# Altium project Hub.PrjPCB
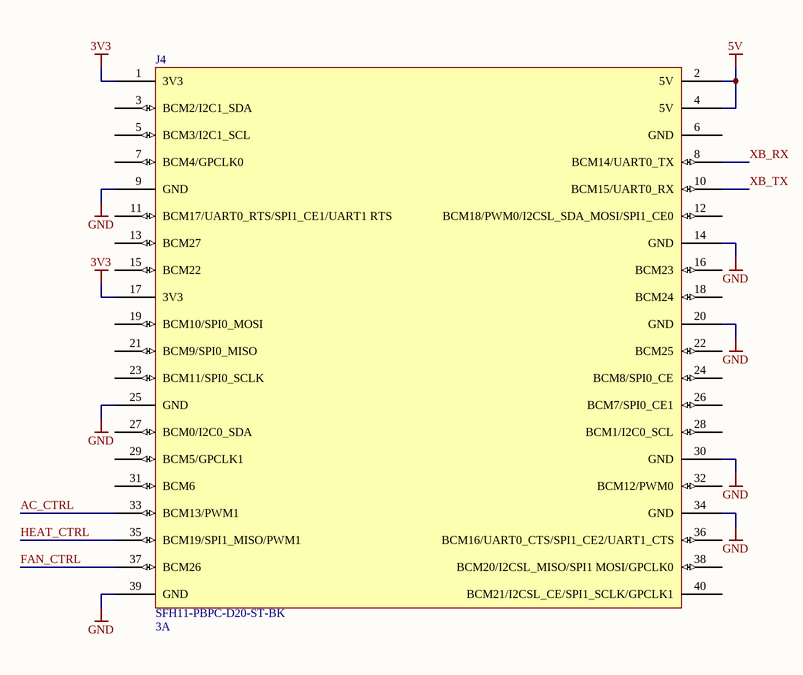
[diagram p0: Rpi.SchDoc]
4 sheets, 66 parts. Net scope: global (net labels, ports and power ports of the same name join across sheets).
Board file: Hub.PcbDoc
Sheets:
  Rpi.SchDoc
  Power.SchDoc
  Control.SchDoc
  Xbee.SchDoc

## Sheet Rpi.SchDoc
size A

### Parts
(Parts that share a designator on the sheet are numbered #1, #2 ... from top to bottom, then left to right.)
J4#1  Rating: 3A  [SFH11-PBPC-D20-ST-BK]  (hidden comment: J_RPI2B_ SFH11-PBPC-D20-ST-BK)

### Nets
3V3: J4#1.1(3V3) J4#1.17(3V3)
5V: J4#1.2(5V) J4#1.4(5V)
GND: J4#1.9(GND) J4#1.14(GND) J4#1.20(GND) J4#1.25(GND) J4#1.30(GND) J4#1.34(GND) J4#1.39(GND)
AC_CTRL: J4#1.33(BCM13/PWM1)
FAN_CTRL: J4#1.37(BCM26)
HEAT_CTRL: J4#1.35(BCM19/SPI1_MISO/PWM1)
XB_RX: J4#1.8(BCM14/UART0_TX)
XB_TX: J4#1.10(BCM15/UART0_RX)

Not connected (* = marked no-connect by the designer): J4#1 3(BCM2/I2C1_SDA) 5(BCM3/I2C1_SCL) 6(GND) 7(BCM4/GPCLK0) 11(BCM17/UART0_RTS/SPI1_CE1/UART1_RTS) 12(BCM18/PWM0/I2CSL_SDA_MOSI/SPI1_CE0) 13(BCM27) 15(BCM22) 16(BCM23) 18(BCM24) 19(BCM10/SPI0_MOSI) 21(BCM9/SPI0_MISO) 22(BCM25) 23(BCM11/SPI0_SCLK) 24(BCM8/SPI0_CE) 26(BCM7/SPI0_CE1) 27(BCM0/I2C0_SDA) 28(BCM1/I2C0_SCL) 29(BCM5/GPCLK1) 31(BCM6) 32(BCM12/PWM0) 36(BCM16/UART0_CTS/SPI1_CE2/UART1_CTS) 38(BCM20/I2CSL_MISO/SPI1_MOSI/GPCLK0) 40(BCM21/I2CSL_CE/SPI1_SCLK/GPCLK1)

### Library data of the parts
J4#1 = J_RPI2B_ SFH11-PBPC-D20-ST-BK: Manufacturer: Sullins Connector Solutions; PartNumber: SFH11-PBPC-D20-ST-BK

## Sheet Power.SchDoc
size A
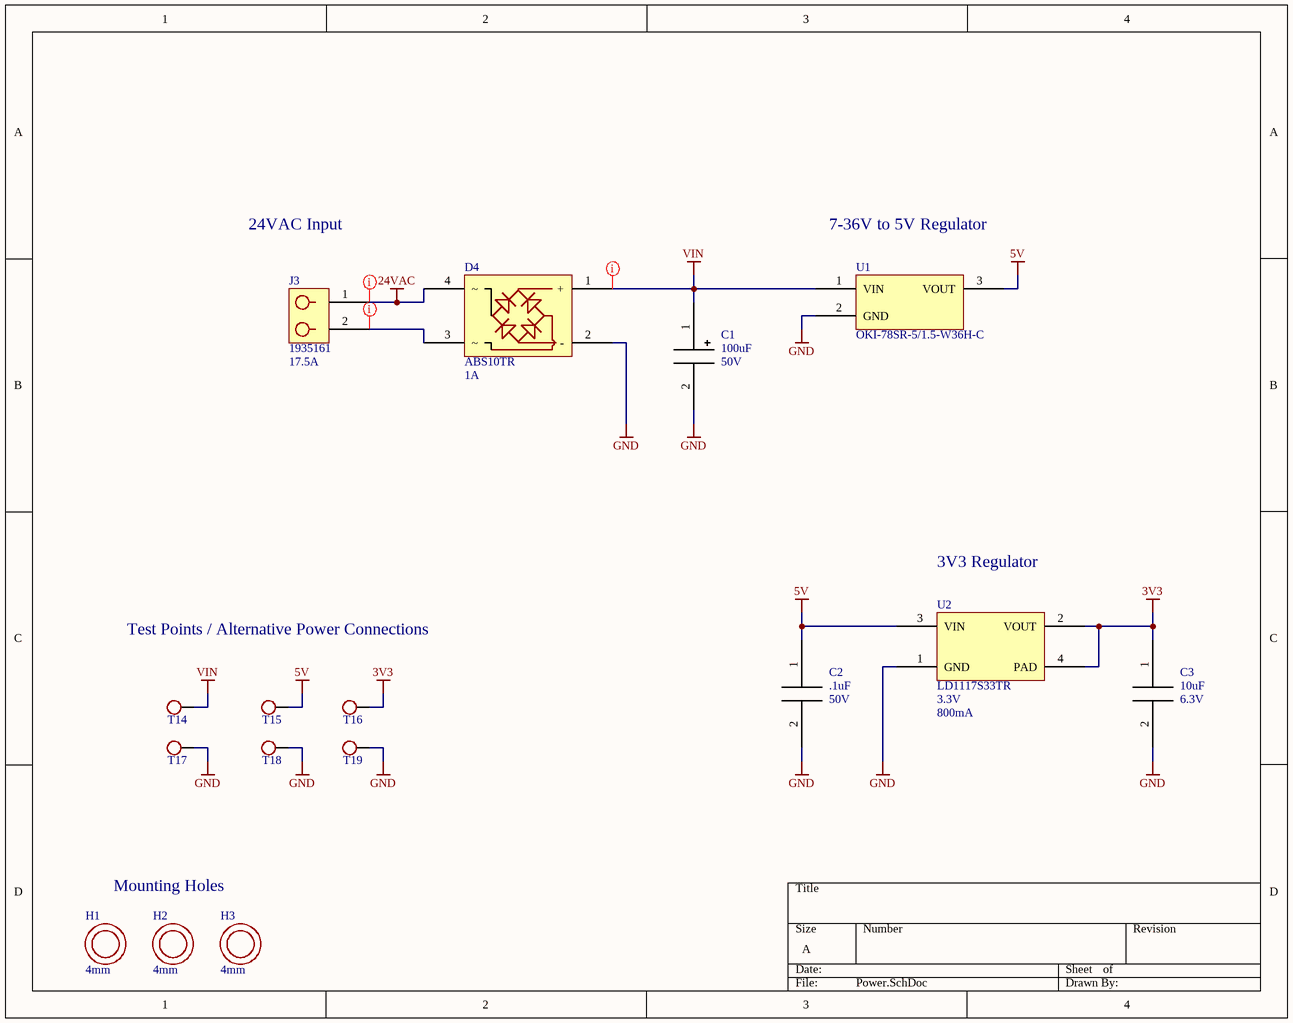
[diagram p1: Power.SchDoc]

### Parts
(Parts that share a designator on the sheet are numbered #1, #2 ... from top to bottom, then left to right.)
C1  value 100uF  Rating: 50V  [EEE-1HA101UP]  (hidden comment: CAP)
C2  value .1uF  Rating: 50V  [0603]  (hidden comment: *)
C3  value 10uF  Rating: 6.3V  [0603]  (hidden comment: *)
D4#1  Rating: 1A  PartNumber: ABS10TR  [ABS]  (hidden comment: D_RECTBRIDGE_ABS)
H1  value 4mm  [MOUNTHOLE4MM]  (hidden comment: H_MOUNTHOLE_MOUNTHOLE4MM)
H2  value 4mm  [MOUNTHOLE4MM]  (hidden comment: H_MOUNTHOLE_MOUNTHOLE4MM)
H3  value 4mm  [MOUNTHOLE4MM]  (hidden comment: H_MOUNTHOLE_MOUNTHOLE4MM)
J3#1  Rating: 17.5A  [1935161]  (hidden comment: J_2POSTERM_1935161)
T14#1  TESTPOINT  [TESTPOINT1MM]  (value not drawn)
T15#1  TESTPOINT  [TESTPOINT1MM]  (value not drawn)
T16#1  TESTPOINT  [TESTPOINT1MM]  (value not drawn)
T17#1  TESTPOINT  [TESTPOINT1MM]  (value not drawn)
T18#1  TESTPOINT  [TESTPOINT1MM]  (value not drawn)
T19#1  TESTPOINT  [TESTPOINT1MM]  (value not drawn)
U1  U_OKI-78SR-5/1.5-W36H-C_OKI-78SR-5/1.5-W36H-C  [OKI-78SR-5/1.5-W36H-C]  (value not drawn)
U2  value 3.3V  Rating: 800mA  PartNumber: LD1117S33TR  [SOT223]  (hidden comment: U_LD1117S33TR_SOT223)

### Nets
3V3: C3.1 T16#1.1 U2.2(VOUT) U2.4(PAD)
5V: C2.1 T15#1.1 U1.3(VOUT) U2.3(VIN)
24VAC: D4#1.4 J3#1.1
GND: C1.2 C2.2 C3.2 D4#1.2(-) T17#1.1 T18#1.1 T19#1.1 U1.2(GND) U2.1(GND)
VIN: C1.1 D4#1.1(+) T14#1.1 U1.1(VIN)
NetD4#1_3: D4#1.3 J3#1.2

### Layout directives
rule Clearance Constraint [Generic clearance = 25mil, and 9 value(s) for objects]; rule Width Constraint [Pref Width = 25mil    Min Width = 15mil    Max Width = 25mil]: 24VAC, NetD4#1_3, VIN

### Notes on the sheet
- 24VAC Input
- 7-36V to 5V Regulator
- 3V3 Regulator
- Test Points / Alternative Power Connections
- Mounting Holes

### Library data of the parts
C1 = C_CAP-P_EEE-1HA101UP: Manufacturer: Panasonic Electronic Components; PartNumber: EEE-1HA101UP
C2 = C_CAP_0603: PartNumber: C0603C104K5RACAUTO; Manufacturer: KEMET
C3 = C_CAP_0603: PartNumber: JMK107ABJ106MA-T; Manufacturer: Taiyo Yuden
D4#1 = D_RECTBRIDGE_ABS: Manufacturer: SMC Diode Solutions
J3#1 = J_2POSTERM_1935161: Manufacturer: Phoenix Contact; PartNumber: 1935161
T14#1 T15#1 T16#1 T17#1 T18#1 T19#1 = T_TESTPOINT_TESTPOINT1MM: Value: 1mm
U1 = U_OKI-78SR-5/1.5-W36H-C_OKI-78SR-5/1.5-W36H-C: Manufacturer: Murata Power Solutions Inc.; Rating: 1.5A; PartNumber: OKI-78SR-5/1.5-W36H-C

## Sheet Control.SchDoc
size A
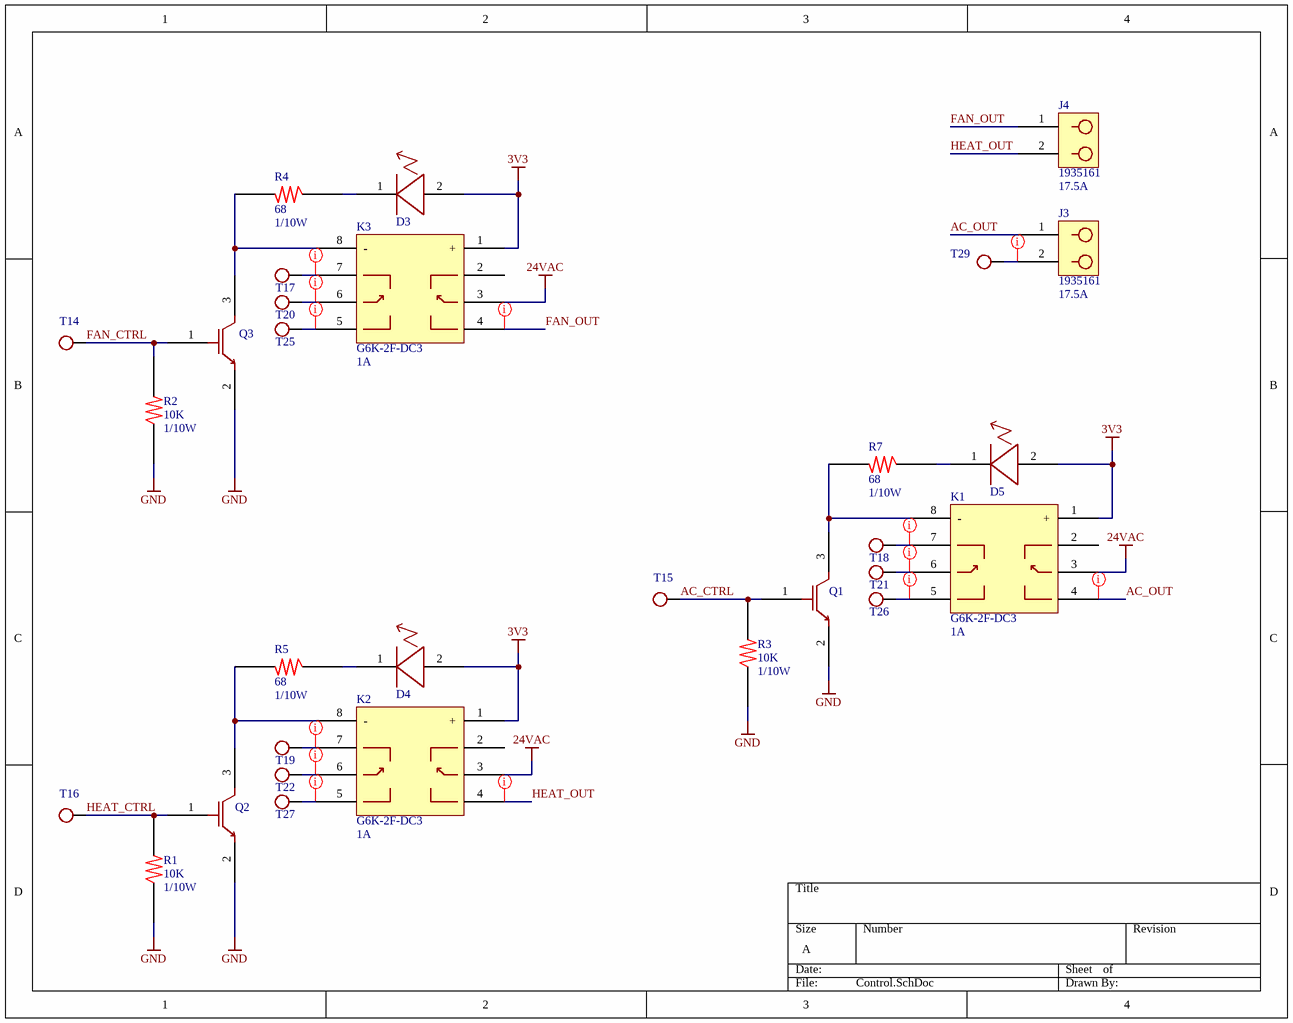
[diagram p2: Control.SchDoc]

### Parts
(Parts that share a designator on the sheet are numbered #1, #2 ... from top to bottom, then left to right.)
D3  D_LED_LED5MM  [LED5MM]  (value not drawn)
D4#2  D_LED_LED5MM  [LED5MM]  (value not drawn)
D5  D_LED_LED5MM  [LED5MM]  (value not drawn)
J3#2  Rating: 17.5A  [1935161]  (hidden comment: J_2POSTERM_1935161)
J4#2  Rating: 17.5A  [1935161]  (hidden comment: J_2POSTERM_1935161)
K1  Rating: 1A  PartNumber: G6K-2F-DC3  [G6K-2F]  (hidden comment: K_G6K-2F_G6K-2F)
K2  Rating: 1A  PartNumber: G6K-2F-DC3  [G6K-2F]  (hidden comment: K_G6K-2F_G6K-2F)
K3  Rating: 1A  PartNumber: G6K-2F-DC3  [G6K-2F]  (hidden comment: K_G6K-2F_G6K-2F)
Q1  Q_NFET_SOT23  [SOT23]  (value not drawn)
Q2  Q_NFET_SOT23  [SOT23]  (value not drawn)
Q3  Q_NFET_SOT23  [SOT23]  (value not drawn)
R1  value 10K  Rating: 1/10W  [0603]  (hidden comment: R_RES_0603)
R2  value 10K  Rating: 1/10W  [0603]  (hidden comment: R_RES_0603)
R3  value 10K  Rating: 1/10W  [0603]  (hidden comment: R_RES_0603)
R4  value 68  Rating: 1/10W  [0603]  (hidden comment: R_RES_0603)
R5  value 68  Rating: 1/10W  [0603]  (hidden comment: R_RES_0603)
R7  value 68  Rating: 1/10W  [0603]  (hidden comment: R_RES_0603)
T14#2  TESTPOINT  [TESTPOINT1MM]  (value not drawn)
T15#2  TESTPOINT  [TESTPOINT1MM]  (value not drawn)
T16#2  TESTPOINT  [TESTPOINT1MM]  (value not drawn)
T17#2  TESTPOINT  [TESTPOINT1MM]  (value not drawn)
T18#2  TESTPOINT  [TESTPOINT1MM]  (value not drawn)
T19#2  TESTPOINT  [TESTPOINT1MM]  (value not drawn)
T20  TESTPOINT  [TESTPOINT1MM]  (value not drawn)
T21  TESTPOINT  [TESTPOINT1MM]  (value not drawn)
T22  TESTPOINT  [TESTPOINT1MM]  (value not drawn)
T25  TESTPOINT  [TESTPOINT1MM]  (value not drawn)
T26  TESTPOINT  [TESTPOINT1MM]  (value not drawn)
T27  TESTPOINT  [TESTPOINT1MM]  (value not drawn)
T29  TESTPOINT  [TESTPOINT1MM]  (value not drawn)

### Nets
3V3: D3.2 D4#2.2 D5.2 K1.1(+) K2.1(+) K3.1(+)
24VAC: K1.3(S1_2) K2.3(S1_2) K3.3(S1_2)
GND: Q1.2(S) Q2.2(S) Q3.2(S) R1.1 R2.1 R3.1
AC_CTRL: Q1.1(G) R3.2 T15#2.1
AC_OUT: J3#2.1 K1.4(S1_3)
FAN_CTRL: Q3.1(G) R2.2 T14#2.1
FAN_OUT: J4#2.1 K3.4(S1_3)
HEAT_CTRL: Q2.1(G) R1.2 T16#2.1
HEAT_OUT: J4#2.2 K2.4(S1_3)
NetD3_1: D3.1 R4.1
NetD4#2_1: D4#2.1 R5.1
NetD5_1: D5.1 R7.1
NetJ3#2_2: J3#2.2 T29.1
NetK1_5: K1.5(S2_3) T26.1
NetK1_6: K1.6(S2_2) T21.1
NetK1_7: K1.7(S2_1) T18#2.1
NetK1_8: K1.8(-) Q1.3(D) R7.2
NetK2_5: K2.5(S2_3) T27.1
NetK2_6: K2.6(S2_2) T22.1
NetK2_7: K2.7(S2_1) T19#2.1
NetK2_8: K2.8(-) Q2.3(D) R5.2
NetK3_5: K3.5(S2_3) T25.1
NetK3_6: K3.6(S2_2) T20.1
NetK3_7: K3.7(S2_1) T17#2.1
NetK3_8: K3.8(-) Q3.3(D) R4.2

Not connected (* = marked no-connect by the designer): K1 2(S1_1); K2 2(S1_1); K3 2(S1_1)

### Layout directives
rule Clearance Constraint [Generic clearance = 25mil, and 9 value(s) for objects]; rule Width Constraint [Pref Width = 25mil    Min Width = 15mil    Max Width = 25mil]: AC_OUT, FAN_OUT, HEAT_OUT, NetJ3#2_2, NetK1_5, NetK1_6, NetK1_7, NetK2_5, NetK2_6, NetK2_7, NetK3_5, NetK3_6, NetK3_7

### Library data of the parts
J3#2 J4#2 = J_2POSTERM_1935161: Manufacturer: Phoenix Contact; PartNumber: 1935161
K1-K3 = K_G6K-2F_G6K-2F: Manufacturer: Omron
Q1-Q3 = Q_NFET_SOT23: Manufacturer: On Semiconductor; PartNumber: BSS138; Rating: 220mA
R1-R3 = R_RES_0603: PartNumber: RC0603JR-0710KL; Manufacturer: Yageo
R4 R5 R7 = R_RES_0603: PartNumber: RC0603FR-0768RL; Manufacturer: Yageo
T14#2 T15#2 T16#2 T17#2 T18#2 T19#2 T20-T22 T25-T27 T29 = T_TESTPOINT_TESTPOINT1MM: Value: 1mm

## Sheet Xbee.SchDoc
size A
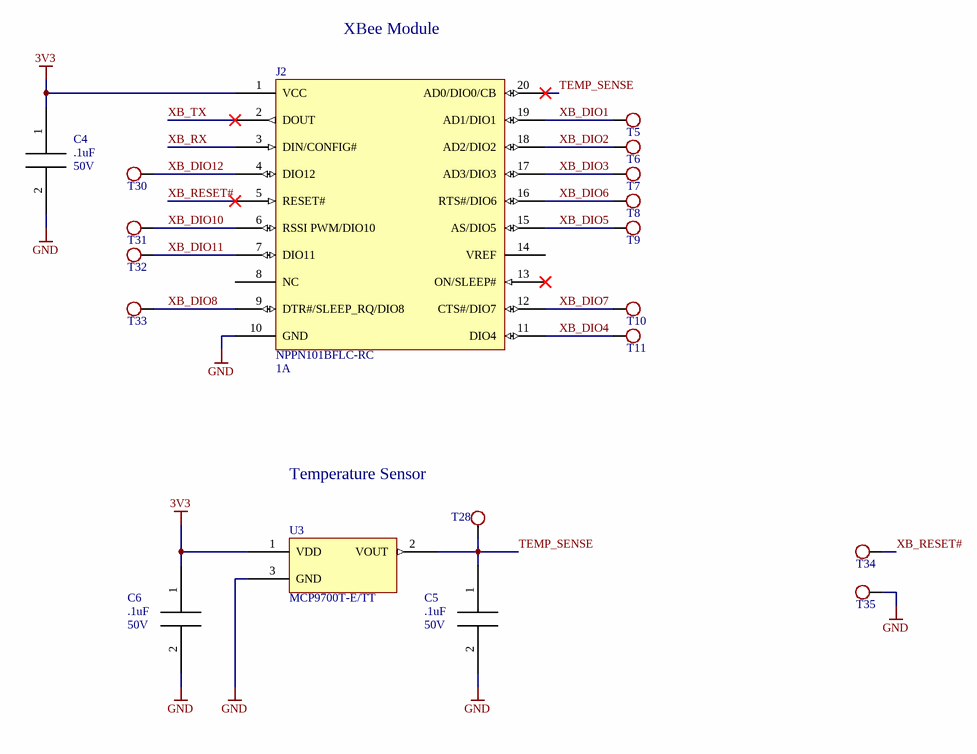
[diagram p3: Xbee.SchDoc]

### Parts
C4  value .1uF  Rating: 50V  [0603]  (hidden comment: *)
C5  value .1uF  Rating: 50V  [0603]  (hidden comment: *)
C6  value .1uF  Rating: 50V  [0603]  (hidden comment: *)
J2  Rating: 1A  [NPPN101BFLC-RC]  (hidden comment: J_XBEE_NPPN101BFLC-RC)
T5  TESTPOINT  [TESTPOINT1MM]  (value not drawn)
T6  TESTPOINT  [TESTPOINT1MM]  (value not drawn)
T7  TESTPOINT  [TESTPOINT1MM]  (value not drawn)
T8  TESTPOINT  [TESTPOINT1MM]  (value not drawn)
T9  TESTPOINT  [TESTPOINT1MM]  (value not drawn)
T10  TESTPOINT  [TESTPOINT1MM]  (value not drawn)
T11  TESTPOINT  [TESTPOINT1MM]  (value not drawn)
T28  TESTPOINT  [TESTPOINT1MM]  (value not drawn)
T30  TESTPOINT  [TESTPOINT1MM]  (value not drawn)
T31  TESTPOINT  [TESTPOINT1MM]  (value not drawn)
T32  TESTPOINT  [TESTPOINT1MM]  (value not drawn)
T33  TESTPOINT  [TESTPOINT1MM]  (value not drawn)
T34  TESTPOINT  [TESTPOINT1MM]  (value not drawn)
T35  TESTPOINT  [TESTPOINT1MM]  (value not drawn)
U3  PartNumber: MCP9700T-E/TT  [TO92]  (hidden comment: U_TEMPSENSE-AN_TO92)

### Nets
3V3: C4.1 C6.1 J2.1(VCC) U3.1(VDD)
GND: C4.2 C5.2 C6.2 J2.10(GND) T35.1 U3.3(GND)
TEMP_SENSE: C5.1 J2.20(AD0/DIO0/CB) T28.1 U3.2(VOUT)
XB_DIO1: J2.19(AD1/DIO1) T5.1
XB_DIO2: J2.18(AD2/DIO2) T6.1
XB_DIO3: J2.17(AD3/DIO3) T7.1
XB_DIO4: J2.11(DIO4) T11.1
XB_DIO5: J2.15(AS/DIO5) T9.1
XB_DIO6: J2.16(RTS#/DIO6) T8.1
XB_DIO7: J2.12(CTS#/DIO7) T10.1
XB_DIO8: J2.9(DTR#/SLEEP_RQ/DIO8) T33.1
XB_DIO10: J2.6(RSSI_PWM/DIO10) T31.1
XB_DIO11: J2.7(DIO11) T32.1
XB_DIO12: J2.4(DIO12) T30.1
XB_RESET#: J2.5(RESET#) T34.1
XB_RX: J2.3(DIN/CONFIG#)
XB_TX: J2.2(DOUT)

Not connected (* = marked no-connect by the designer): J2 8(NC) 13(ON/SLEEP#)* 14(VREF)

### Notes on the sheet
- XBee Module
- Temperature Sensor

### Library data of the parts
C4-C6 = C_CAP_0603: as C2 on sheet Power
J2 = J_XBEE_NPPN101BFLC-RC: Manufacturer: Sullins Connector Solutions; PartNumber: NPPN101BFLC-RC
T5-T11 T28 T30-T35 = T_TESTPOINT_TESTPOINT1MM: Value: 1mm
U3 = U_TEMPSENSE-AN_TO92: Manufacturer: Microchip

## Nets that join several sheets
3V3: Rpi (J4#1.1 J4#1.17), Power (C3.1 T16#1.1 U2.2 U2.4), Control (6 pins), Xbee (C4.1 C6.1 J2.1 U3.1)
5V: Rpi (J4#1.2 J4#1.4), Power (C2.1 T15#1.1 U1.3 U2.3)
24VAC: Power (D4#1.4 J3#1.1), Control (K1.3 K2.3 K3.3)
GND: Rpi (7 pins), Power (9 pins), Control (6 pins), Xbee (6 pins)
AC_CTRL: Rpi (J4#1.33), Control (Q1.1 R3.2 T15#2.1)
FAN_CTRL: Rpi (J4#1.37), Control (Q3.1 R2.2 T14#2.1)
HEAT_CTRL: Rpi (J4#1.35), Control (Q2.1 R1.2 T16#2.1)
XB_RX: Rpi (J4#1.8), Xbee (J2.3)
XB_TX: Rpi (J4#1.10), Xbee (J2.2)